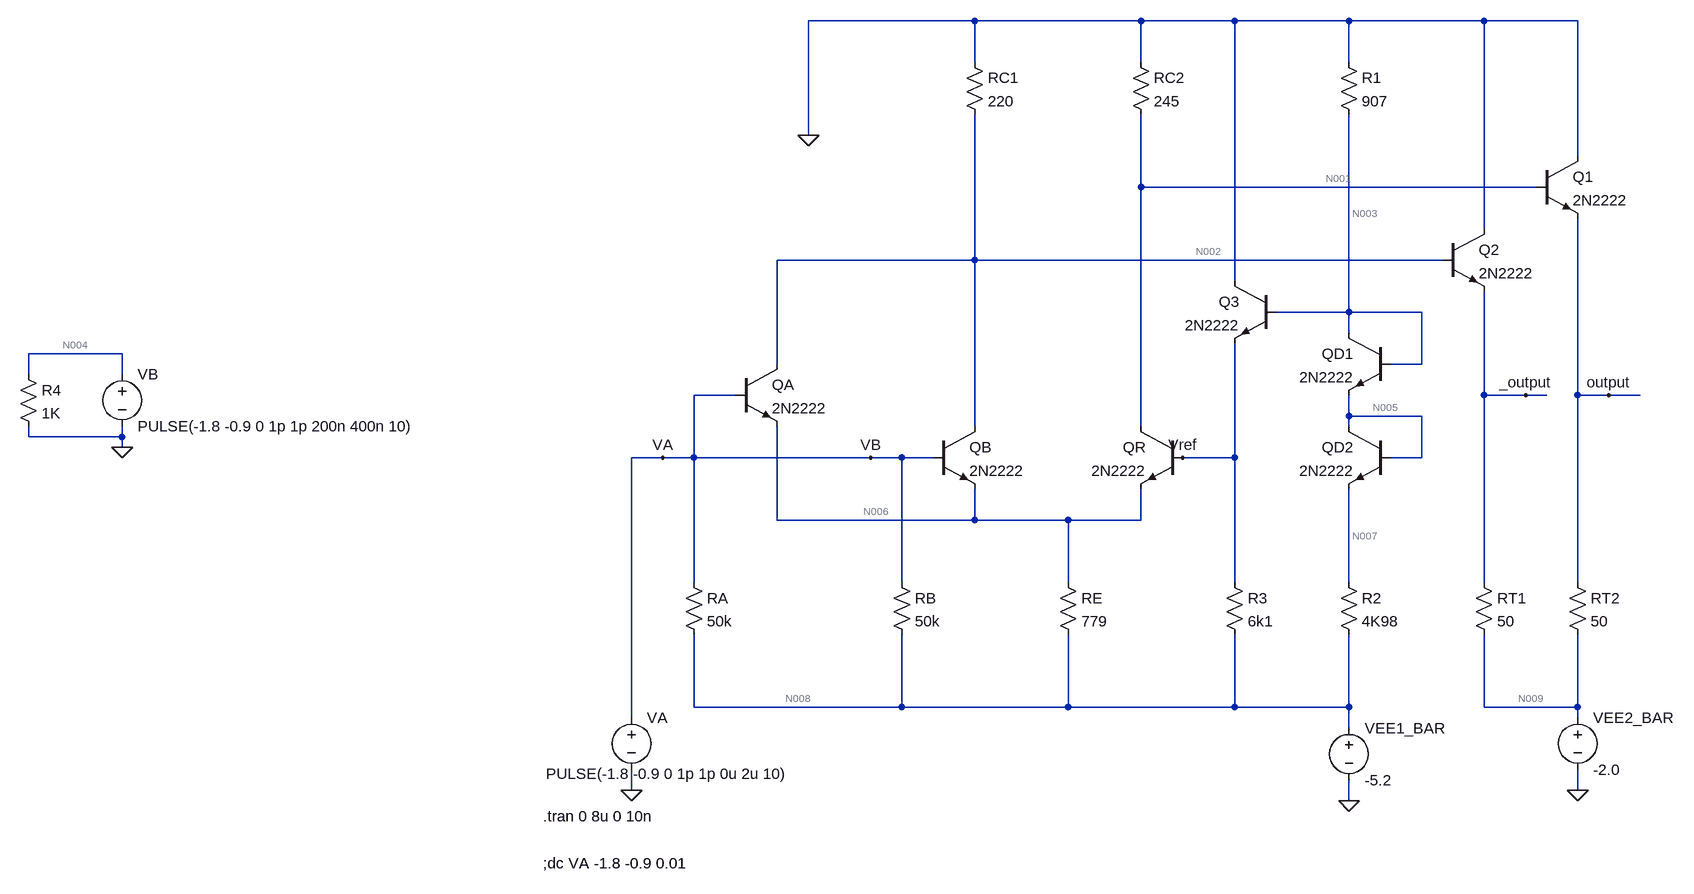
[diagram p0: schematic ECL.asc]
ECL.asc, the LTspice schematic file:
Version 4
SHEET 1 880 1220
WIRE -448 -496 -704 -496
WIRE -192 -496 -448 -496
WIRE -48 -496 -192 -496
WIRE 128 -496 -48 -496
WIRE 336 -496 128 -496
WIRE 480 -496 336 -496
WIRE -448 -432 -448 -496
WIRE -192 -432 -192 -496
WIRE 128 -432 128 -496
WIRE -704 -320 -704 -496
WIRE 480 -288 480 -496
WIRE -192 -240 -192 -352
WIRE 416 -240 -192 -240
WIRE 336 -176 336 -496
WIRE -448 -128 -448 -352
WIRE -448 -128 -752 -128
WIRE 272 -128 -448 -128
WIRE -48 -96 -48 -496
WIRE 128 -48 128 -352
WIRE 128 -48 16 -48
WIRE 240 -48 128 -48
WIRE 128 -16 128 -48
WIRE -1760 16 -1904 16
WIRE -752 32 -752 -128
WIRE 240 32 240 -48
WIRE 240 32 192 32
WIRE -1904 48 -1904 16
WIRE -1760 48 -1760 16
WIRE -816 80 -880 80
WIRE 336 80 336 -80
WIRE 400 80 336 80
WIRE 432 80 400 80
WIRE 480 80 480 -192
WIRE 528 80 480 80
WIRE 576 80 528 80
WIRE 128 112 128 80
WIRE 240 112 128 112
WIRE -448 128 -448 -128
WIRE -192 128 -192 -240
WIRE 128 128 128 112
WIRE -1904 144 -1904 128
WIRE -1760 144 -1760 128
WIRE -1760 144 -1904 144
WIRE -1760 160 -1760 144
WIRE -928 176 -976 176
WIRE -880 176 -880 80
WIRE -880 176 -928 176
WIRE -608 176 -880 176
WIRE -560 176 -608 176
WIRE -512 176 -560 176
WIRE -48 176 -48 0
WIRE -48 176 -128 176
WIRE 240 176 240 112
WIRE 240 176 192 176
WIRE -752 272 -752 128
WIRE -448 272 -448 224
WIRE -448 272 -752 272
WIRE -304 272 -448 272
WIRE -192 272 -192 224
WIRE -192 272 -304 272
WIRE -880 368 -880 176
WIRE -560 368 -560 176
WIRE -304 368 -304 272
WIRE -48 368 -48 176
WIRE 128 368 128 224
WIRE 336 368 336 80
WIRE 480 368 480 80
WIRE -880 560 -880 448
WIRE -560 560 -560 448
WIRE -560 560 -880 560
WIRE -304 560 -304 448
WIRE -304 560 -560 560
WIRE -48 560 -48 448
WIRE -48 560 -304 560
WIRE 128 560 128 448
WIRE 128 560 -48 560
WIRE 336 560 336 448
WIRE 480 560 480 448
WIRE 480 560 336 560
WIRE -976 576 -976 176
WIRE 480 576 480 560
WIRE 128 592 128 560
WIRE -976 688 -976 656
WIRE 480 688 480 656
WIRE 128 704 128 672
FLAG -704 -320 0
FLAG -976 688 0
FLAG 128 704 0
FLAG 480 688 0
FLAG 528 80 output
FLAG 400 80 _output
FLAG -928 176 VA
FLAG -608 176 VB
FLAG -1760 160 0
FLAG -128 176 Vref
DATAFLAG 48 -48 ""
DATAFLAG -80 176 ""
SYMBOL npn 416 -288 R0
SYMATTR InstName Q1
SYMATTR Value 2N2222
SYMBOL npn 272 -176 R0
SYMATTR InstName Q2
SYMATTR Value 2N2222
SYMBOL npn 192 -16 M0
SYMATTR InstName QD1
SYMATTR Value 2N2222
SYMBOL npn 192 128 M0
SYMATTR InstName QD2
SYMATTR Value 2N2222
SYMBOL npn -128 128 M0
SYMATTR InstName QR
SYMATTR Value 2N2222
SYMBOL npn -512 128 R0
SYMATTR InstName QB
SYMATTR Value 2N2222
SYMBOL npn -816 32 R0
SYMATTR InstName QA
SYMATTR Value 2N2222
SYMBOL npn 16 -96 M0
SYMATTR InstName Q3
SYMATTR Value 2N2222
SYMBOL res 112 -448 R0
SYMATTR InstName R1
SYMATTR Value 907
SYMBOL res -208 -448 R0
SYMATTR InstName RC2
SYMATTR Value 245
SYMBOL res -464 -448 R0
SYMATTR InstName RC1
SYMATTR Value 220
SYMBOL res 464 352 R0
SYMATTR InstName RT2
SYMATTR Value 50
SYMBOL res 320 352 R0
SYMATTR InstName RT1
SYMATTR Value 50
SYMBOL res 112 352 R0
SYMATTR InstName R2
SYMATTR Value 4K98
SYMBOL res -64 352 R0
SYMATTR InstName R3
SYMATTR Value 6k1
SYMBOL res -320 352 R0
SYMATTR InstName RE
SYMATTR Value 779
SYMBOL res -576 352 R0
SYMATTR InstName RB
SYMATTR Value 50k
SYMBOL res -896 352 R0
SYMATTR InstName RA
SYMATTR Value 50k
SYMBOL voltage -976 560 R0
WINDOW 3 -132 102 Left 2
WINDOW 123 0 0 Left 2
WINDOW 39 0 0 Left 2
SYMATTR Value PULSE(-1.8 -0.9 0 1p 1p 0u 2u 10)
SYMATTR InstName VA
SYMBOL voltage -1760 32 R0
WINDOW 123 0 0 Left 2
WINDOW 39 0 0 Left 2
SYMATTR InstName VB
SYMATTR Value PULSE(-1.8 -0.9 0 1p 1p 200n 400n 10)
SYMBOL voltage 128 576 R0
SYMATTR InstName VEE1_BAR
SYMATTR Value -5.2
SYMBOL voltage 480 560 R0
SYMATTR InstName VEE2_BAR
SYMATTR Value -2.0
SYMBOL res -1920 32 R0
SYMATTR InstName R4
SYMATTR Value 1K
TEXT -1112 728 Left 2 !.tran 0 8u 0 10n
TEXT -1112 800 Left 2 !;dc VA -1.8 -0.9 0.01

The netlist it stands for:
* ECL.asc
Q1 0 N001 output 0 2N2222
Q2 0 N002 _output 0 2N2222
QD1 N003 N003 N005 0 2N2222
QD2 N005 N005 N007 0 2N2222
QR N001 Vref N006 0 2N2222
QB N002 VB N006 0 2N2222
QA N002 VB N006 0 2N2222
Q3 0 N003 Vref 0 2N2222
R1 0 N003 907
RC2 0 N001 245
RC1 0 N002 220
RT2 output N009 50
RT1 _output N009 50
R2 N007 N008 4K98
R3 Vref N008 6k1
RE N006 N008 779
RB VB N008 50k
RA VB N008 50k
VA VB 0 PULSE(-1.8 -0.9 0 1p 1p 0u 2u 10)
VB N004 0 PULSE(-1.8 -0.9 0 1p 1p 200n 400n 10)
VEE1_BAR N008 0 -5.2
VEE2_BAR N009 0 -2.0
R4 N004 0 1K
.model NPN NPN
.model PNP PNP
.lib standard.bjt
.tran 0 8u 0 10n
;dc VA -1.8 -0.9 0.01
.backanno
.end

* Results of the author's LTspice run, read from the files saved beside the schematic
* Operating Point, zero values left out:
*   V(n001) = -1.026 V
*   V(output) = -1.726 V
*   V(n002) = -28.98 mV
*   V(_output) = -774.9 mV
*   V(n003) = -605.1 mV
*   V(n005) = -1.25 V
*   V(n007) = -1.894 V
*   V(vref) = -1.25 V
*   V(n006) = -1.943 V
*   V(vb) = -1.8 V
*   V(n009) = -2 V
*   V(n008) = -5.2 V
*   V(n004) = -1.8 V
*   Ic(Q3) = 665.3 µA
*   Ib(Q3) = 3.314 µA
*   Ie(Q3) = -668.6 µA
*   Ic(Qa) = 4.342 pA
*   Ib(Qa) = -1.619 pA
*   Ie(Qa) = -2.722 pA
*   Ic(Qb) = 4.342 pA
*   Ib(Qb) = -1.619 pA
*   Ie(Qb) = -2.722 pA
*   Ic(Qr) = 4.16 mA
*   Ib(Qr) = 21.04 µA
*   Ie(Qr) = -4.181 mA
*   Ic(Qd2) = 660.5 µA
*   Ib(Qd2) = 3.31 µA
*   Ie(Qd2) = -663.8 µA
*   Ic(Qd1) = 660.5 µA
*   Ib(Qd1) = 3.31 µA
*   Ie(Qd1) = -663.8 µA
*   Ic(Q2) = 24.37 mA
*   Ib(Q2) = 131.7 µA
*   Ie(Q2) = -24.5 mA
*   Ic(Q1) = 5.444 mA
*   Ib(Q1) = 27.43 µA
*   Ie(Q1) = -5.472 mA
*   I(R4) = -1.8 mA
*   I(Ra) = 68 µA
*   I(Rb) = 68 µA
*   I(Re) = 4.181 mA
*   I(R3) = 647.6 µA
*   I(R2) = 663.8 µA
*   I(Rt1) = 24.5 mA
*   I(Rt2) = 5.472 mA
*   I(Rc1) = 131.7 µA
*   I(Rc2) = 4.187 mA
*   I(R1) = 667.1 µA
*   I(Vee2_bar) = 29.97 mA
*   I(Vee1_bar) = 5.628 mA
*   I(Vb) = 1.8 mA
*   I(Va) = -136 µA
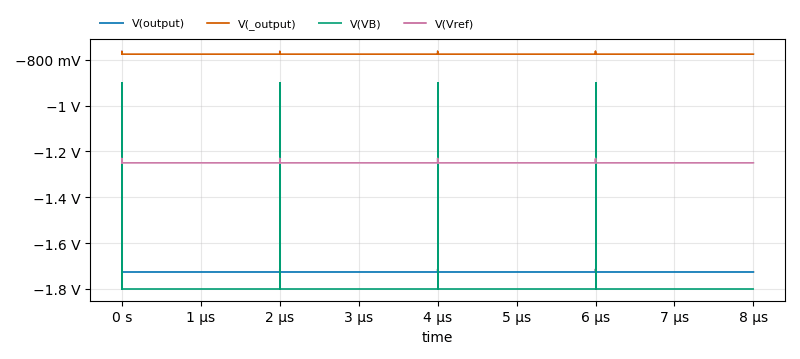
[diagram p1: Transient Analysis of ECL.asc, plotted from the saved traces]
* Transient Analysis, 1 run:
*   V(output): min -1.726 V, max -1.714 V, average -1.726 V, rms 1.726 V, last -1.726 V
*   V(_output): min -775.1 mV, max -762.2 mV, average -774.9 mV, rms 774.9 mV, last -774.9 mV
*   V(VB): min -1.8 V, max -900 mV, average -1.8 V, rms 1.8 V, last -1.8 V
*   V(Vref): min -1.25 V, max -1.23 V, average -1.25 V, rms 1.25 V, last -1.25 V